# Altium schematic sheet 船核心板.SchDoc
size A2; Organization: Altium Limited; Address1: L3, 12a Rodborough Rd; Address2: Frenchs Forest; Address3: NSW; Address4: Australia 2086
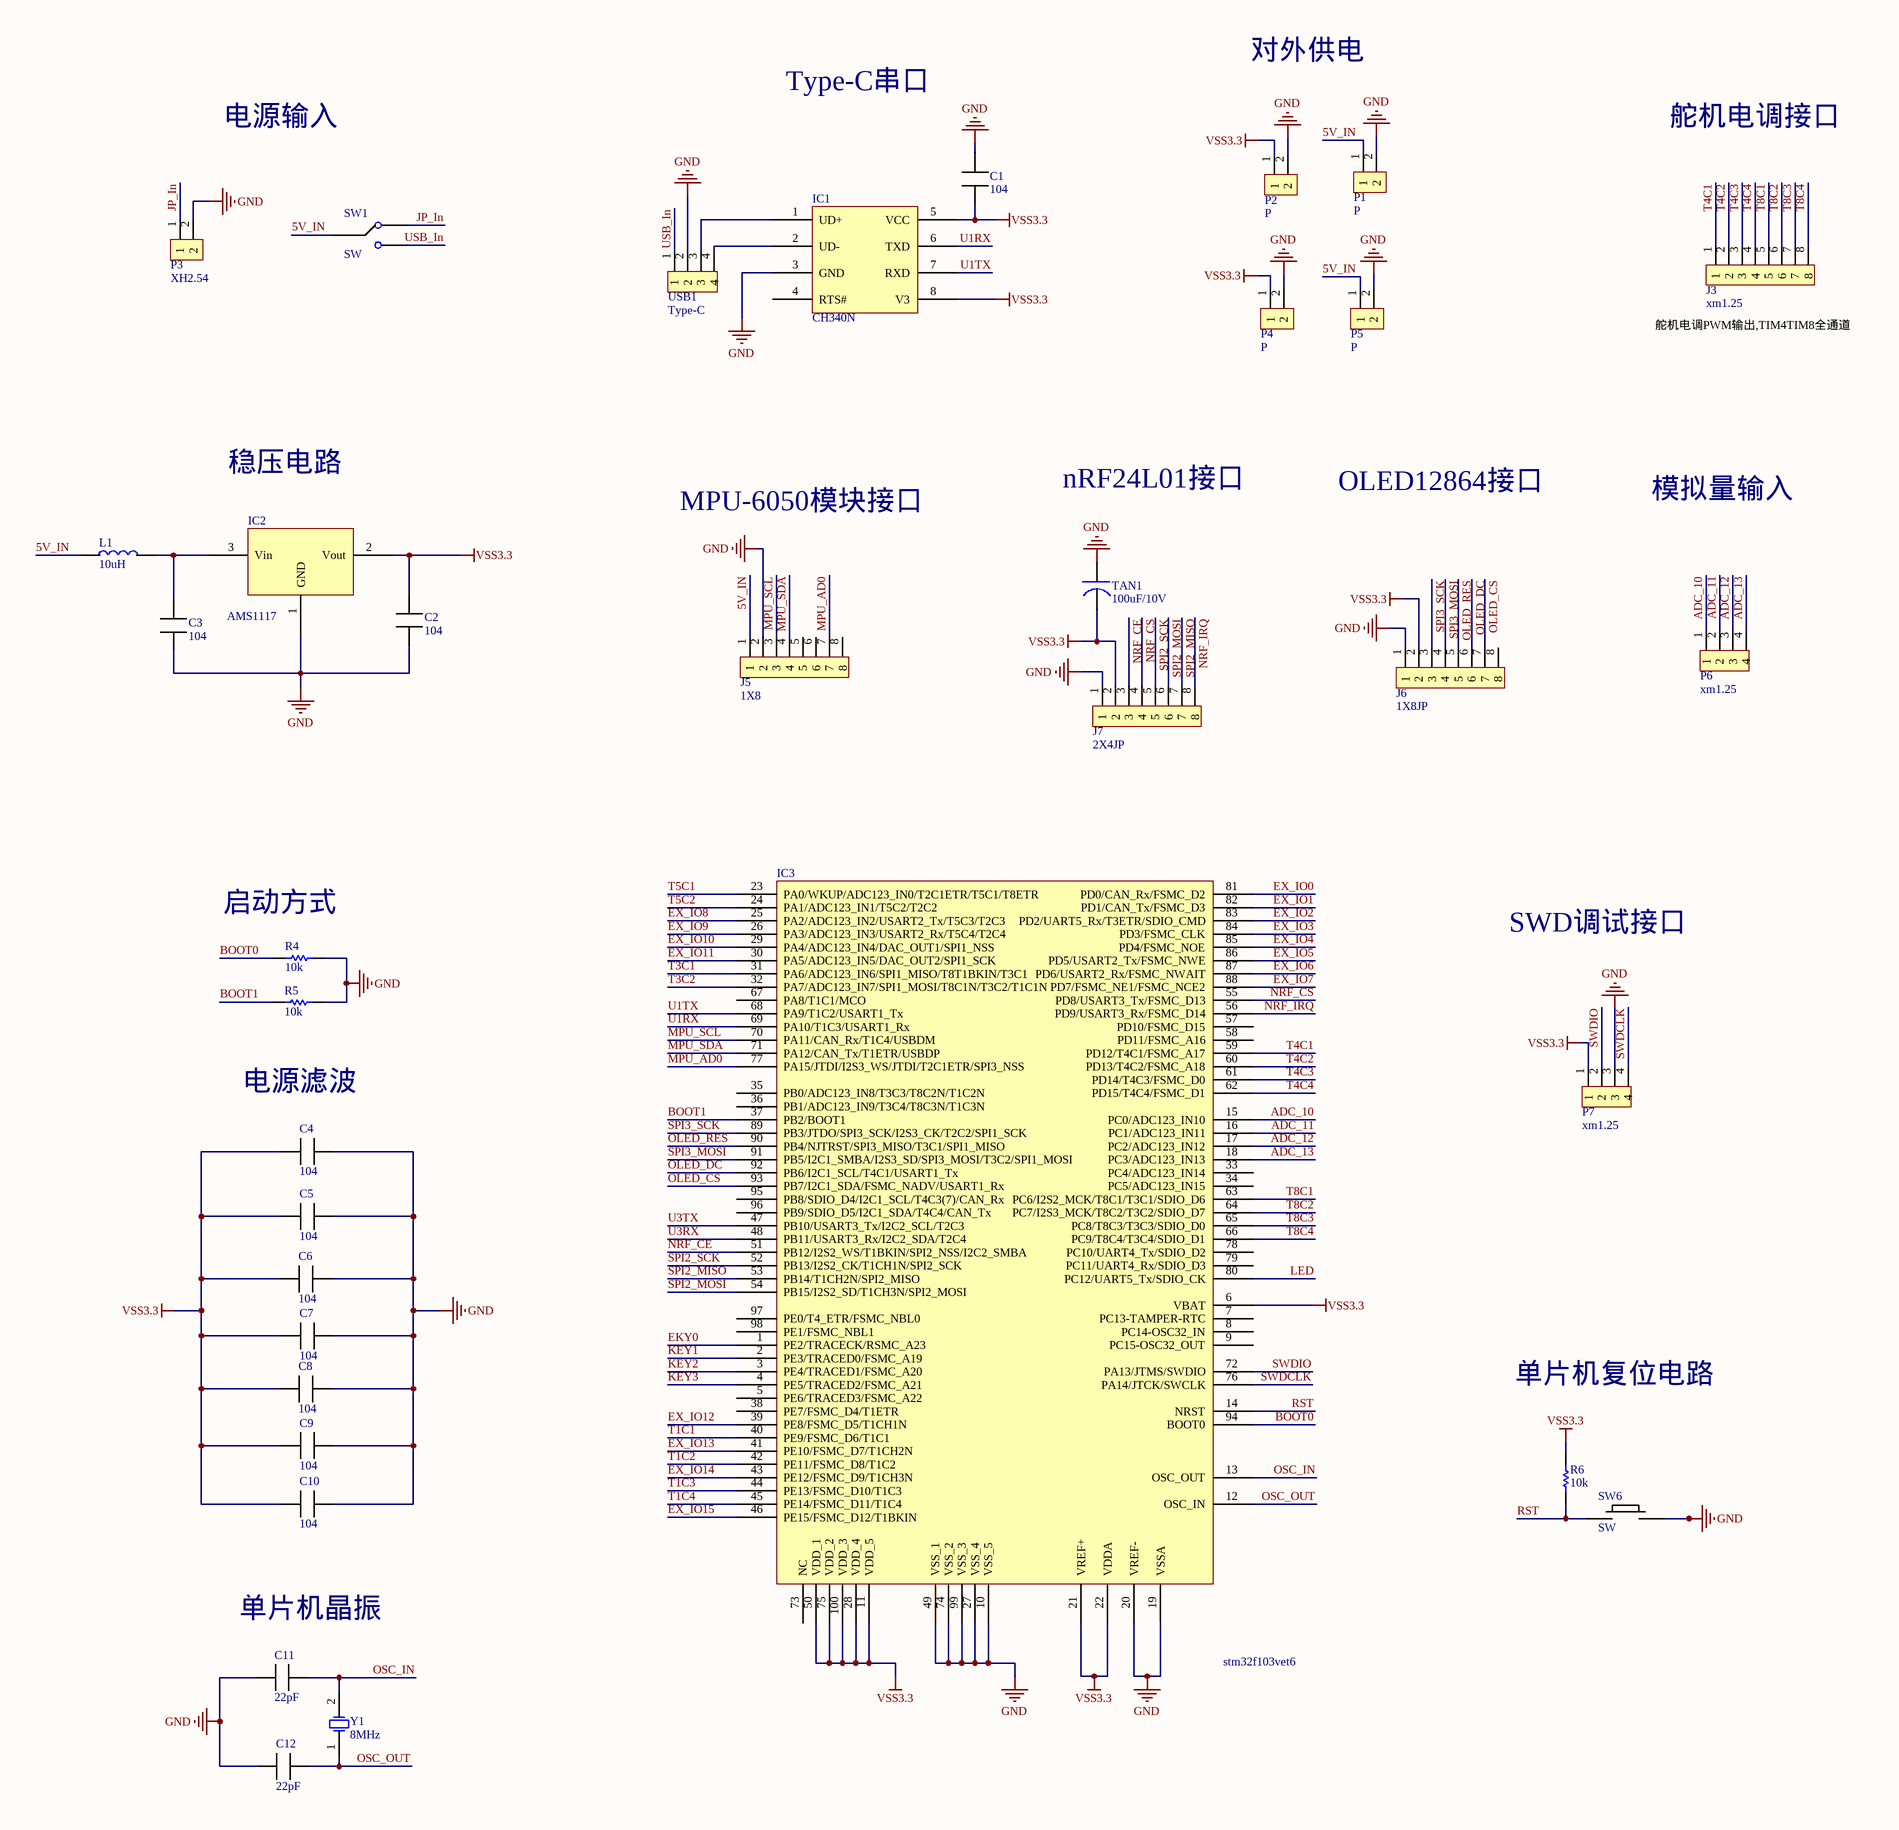
[diagram p0: 船核心板.SchDoc, left]
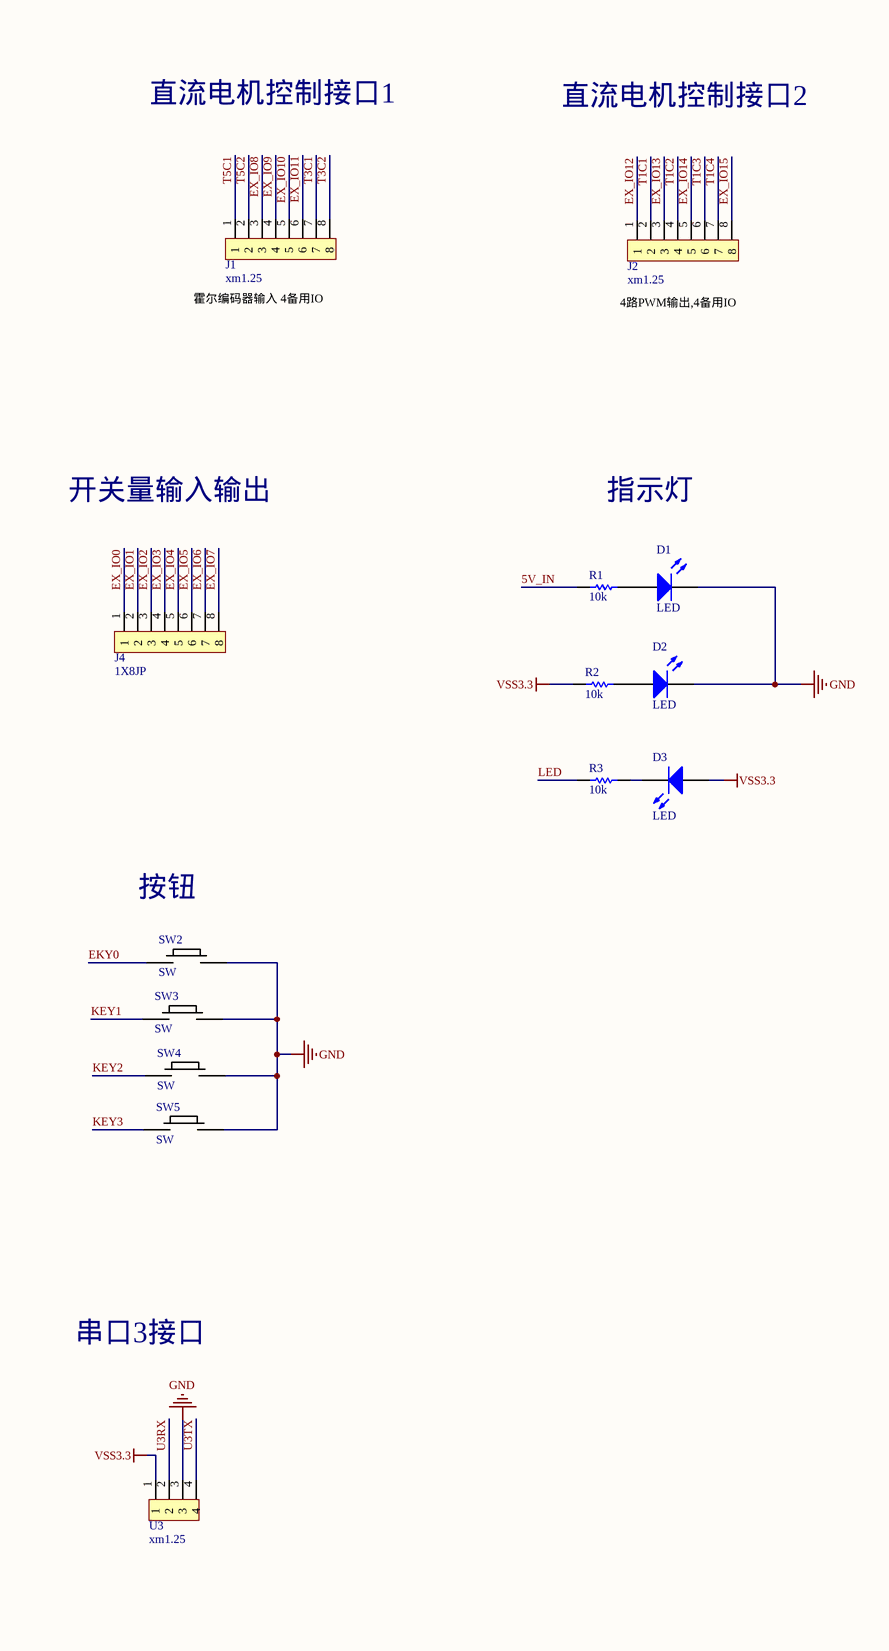
[diagram p1: 船核心板.SchDoc, right]

## Parts
C1  104  [C 0603]
C2  104  [C 0603]
C3  104  [C 0603]
C4  104  [C 0603]
C5  104  [C 0603]
C6  104  [C 0603]
C7  104  [C 0603]
C8  104  [C 0603]
C9  104  [C 0603]
C10  104  [C 0603]
C11  22pF  [C 0603]
C12  22pF  [C 0603]
D1  LED  [LED 0603]
D2  LED  [LED 0603]
D3  LED  [LED 0603]
IC1  CH340N  [SOP-8]
IC2  AMS1117  [SOT-223]
IC3  stm32f103vet6  [LQPF100 12X12]
J1  xm1.25  [MX1.25 8P]
J2  xm1.25  [MX1.25 8P]
J3  xm1.25  [MX1.25 8P]
J4  1X8JP  [HDR2.54-M-LI-8P]
J5  1X8  [HDR2.54-M-LI-8P]
J6  1X8JP  [HDR2.54-M-LI-8P]
J7  2X4JP  [HDR2.54-LI-2x4P]
L1  10uH  [L 0603]
P1  P  [XH2.54 2P]
P2  P  [XH2.54 2P]
P3  XH2.54  [XH2.54 2P]
P4  P  [XH2.54 2P]
P5  P  [XH2.54 2P]
P6  xm1.25  [MX1.25]
P7  xm1.25  [MX1.25]
R1  10k  [R 0603]
R2  10k  [R 0603]
R3  10k  [R 0603]
R4  10k  [R 0603]
R5  10k  [R 0603]
R6  10k  [R 0603]
SW1  SW  [拨动开关 9X3.5X3.5 侧卧]
SW2  SW  [SW SMD 3x6x2.5]
SW3  SW  [SW SMD 3x6x2.5]
SW4  SW  [SW SMD 3x6x2.5]
SW5  SW  [SW SMD 3x6x2.5]
SW6  SW  [SW SMD 3x6x2.5]
TAN1  100uF/10V  [6.3*5.4mm 电解电容]
U3  xm1.25  [2.54 _ 4Pin]
USB1  Type-C  [USB Type-C]
Y1  8MHz  [OSC SMD]

## Nets
GND: C1.2 C2.1 C3.1 C4.2 C5.2 C6.2 C7.2 C8.2 C9.2 C10.2 C11.1 C12.1 D1.2(K) D2.2(K) IC1.3(GND) IC2.1(GND) IC3.10(VSS_5) IC3.19(VSSA) IC3.20(VREF-) IC3.27(VSS_4) IC3.49(VSS_1) IC3.74(VSS_2) IC3.99(VSS_3) J5.2 J6.1 J7.1 P1.2 P2.2 P3.2 P4.2 P5.2 P7.3 R4.2 R5.2 SW2.2 SW3.2 SW4.2 SW5.2 SW6.2 TAN1.2 U3.3 USB1.2
VSS3.3: C1.1 C2.2 C4.1 C5.1 C6.1 C7.1 C8.1 C9.1 C10.1 D3.1(A) IC1.5(VCC) IC1.8(V3) IC2.2(Vout) IC3.6(VBAT) IC3.11(VDD_5) IC3.21(VREF+) IC3.22(VDDA) IC3.28(VDD_4) IC3.50(VDD_1) IC3.75(VDD_2) IC3.100(VDD_3) J6.2 J7.2 P2.1 P4.1 P7.1 R2.1 R6.2 TAN1.1 U3.1
5V_IN: J5.1 L1.1 P1.1 P5.1 R1.1 SW1.1
ADC_10: IC3.15(PC0/ADC123_IN10) P6.1
ADC_11: IC3.16(PC1/ADC123_IN11) P6.2
ADC_12: IC3.17(PC2/ADC123_IN12) P6.3
ADC_13: IC3.18(PC3/ADC123_IN13) P6.4
BOOT0: IC3.94(BOOT0) R4.1
BOOT1: IC3.37(PB2/BOOT1) R5.1
EKY0: IC3.1(PE2/TRACECK/RSMC_A23) SW2.1
EX_IO0: IC3.81(PD0/CAN_Rx/FSMC_D2) J4.1
EX_IO1: IC3.82(PD1/CAN_Tx/FSMC_D3) J4.2
EX_IO2: IC3.83(PD2/UART5_Rx/T3ETR/SDIO_CMD) J4.3
EX_IO3: IC3.84(PD3/FSMC_CLK) J4.4
EX_IO4: IC3.85(PD4/FSMC_NOE) J4.5
EX_IO5: IC3.86(PD5/USART2_Tx/FSMC_NWE) J4.6
EX_IO6: IC3.87(PD6/USART2_Rx/FSMC_NWAIT) J4.7
EX_IO7: IC3.88(PD7/FSMC_NE1/FSMC_NCE2) J4.8
EX_IO8: IC3.25(PA2/ADC123_IN2/USART2_Tx/T5C3/T2C3) J1.3
EX_IO9: IC3.26(PA3/ADC123_IN3/USART2_Rx/T5C4/T2C4) J1.4
EX_IO10: IC3.29(PA4/ADC123_IN4/DAC_OUT1/SPI1_NSS) J1.5
EX_IO11: IC3.30(PA5/ADC123_IN5/DAC_OUT2/SPI1_SCK) J1.6
EX_IO12: IC3.39(PE8/FSMC_D5/T1CH1N) J2.1
EX_IO13: IC3.41(PE10/FSMC_D7/T1CH2N) J2.3
EX_IO14: IC3.43(PE12/FSMC_D9/T1CH3N) J2.5
EX_IO15: IC3.46(PE15/FSMC_D12/T1BKIN) J2.8
JP_In: P3.1 SW1.2
KEY1: IC3.2(PE3/TRACED0/FSMC_A19) SW3.1
KEY2: IC3.3(PE4/TRACED1/FSMC_A20) SW4.1
KEY3: IC3.4(PE5/TRACED2/FSMC_A21) SW5.1
LED: IC3.80(PC12/UART5_Tx/SDIO_CK) R3.1
MPU_AD0: IC3.77(PA15/JTDI/I2S3_WS/JTDI/T2C1ETR/SPI3_NSS) J5.7
MPU_SCL: IC3.70(PA11/CAN_Rx/T1C4/USBDM) J5.3
MPU_SDA: IC3.71(PA12/CAN_Tx/T1ETR/USBDP) J5.4
NRF_CE: IC3.51(PB12/I2S2_WS/T1BKIN/SPI2_NSS/I2C2_SMBA) J7.3
NRF_CS: IC3.55(PD8/USART3_Tx/FSMC_D13) J7.4
NRF_IRQ: IC3.56(PD9/USART3_Rx/FSMC_D14) J7.8
OLED_CS: IC3.93(PB7/I2C1_SDA/FSMC_NADV/USART1_Rx) J6.7
OLED_DC: IC3.92(PB6/I2C1_SCL/T4C1/USART1_Tx) J6.6
OLED_RES: IC3.90(PB4/NJTRST/SPI3_MISO/T3C1/SPI1_MISO) J6.5
OSC_IN: C11.2 IC3.13(OSC_OUT) Y1.2(OSC2)
OSC_OUT: C12.2 IC3.12(OSC_IN) Y1.1(OSC1)
RST: IC3.14(NRST) R6.1 SW6.1
SPI2_MISO: IC3.53(PB14/T1CH2N/SPI2_MISO) J7.7
SPI2_MOSI: IC3.54(PB15/I2S2_SD/T1CH3N/SPI2_MOSI) J7.6
SPI2_SCK: IC3.52(PB13/I2S2_CK/T1CH1N/SPI2_SCK) J7.5
SPI3_MOSI: IC3.91(PB5/I2C1_SMBA/I2S3_SD/SPI3_MOSI/T3C2/SPI1_MOSI) J6.4
SPI3_SCK: IC3.89(PB3/JTDO/SPI3_SCK/I2S3_CK/T2C2/SPI1_SCK) J6.3
SWDCLK: IC3.76(PA14/JTCK/SWCLK) P7.4
SWDIO: IC3.72(PA13/JTMS/SWDIO) P7.2
T1C1: IC3.40(PE9/FSMC_D6/T1C1) J2.2
T1C2: IC3.42(PE11/FSMC_D8/T1C2) J2.4
T1C3: IC3.44(PE13/FSMC_D10/T1C3) J2.6
T1C4: IC3.45(PE14/FSMC_D11/T1C4) J2.7
T3C1: IC3.31(PA6/ADC123_IN6/SPI1_MISO/T8T1BKIN/T3C1) J1.7
T3C2: IC3.32(PA7/ADC123_IN7/SPI1_MOSI/T8C1N/T3C2/T1C1N) J1.8
T4C1: IC3.59(PD12/T4C1/FSMC_A17) J3.1
T4C2: IC3.60(PD13/T4C2/FSMC_A18) J3.2
T4C3: IC3.61(PD14/T4C3/FSMC_D0) J3.3
T4C4: IC3.62(PD15/T4C4/FSMC_D1) J3.4
T5C1: IC3.23(PA0/WKUP/ADC123_IN0/T2C1ETR/T5C1/T8ETR) J1.1
T5C2: IC3.24(PA1/ADC123_IN1/T5C2/T2C2) J1.2
T8C1: IC3.63(PC6/I2S2_MCK/T8C1/T3C1/SDIO_D6) J3.5
T8C2: IC3.64(PC7/I2S3_MCK/T8C2/T3C2/SDIO_D7) J3.6
T8C3: IC3.65(PC8/T8C3/T3C3/SDIO_D0) J3.7
T8C4: IC3.66(PC9/T8C4/T3C4/SDIO_D1) J3.8
U1RX: IC1.6(TXD) IC3.69(PA10/T1C3/USART1_Rx)
U1TX: IC1.7(RXD) IC3.68(PA9/T1C2/USART1_Tx)
U3RX: IC3.48(PB11/USART3_Rx/I2C2_SDA/T2C4) U3.2
U3TX: IC3.47(PB10/USART3_Tx/I2C2_SCL/T2C3) U3.4
USB_In: SW1.3 USB1.1
NetC3_2: C3.2 IC2.3(Vin) L1.2
NetD1_1: D1.1(A) R1.2
NetD2_1: D2.1(A) R2.2
NetD3_2: D3.2(K) R3.2
NetIC1_1: IC1.1(UD+) USB1.3
NetIC1_2: IC1.2(UD-) USB1.4

Not connected (* = marked no-connect by the designer): IC1 4(RTS#); IC3 5(PE6/TRACED3/FSMC_A22) 7(PC13-TAMPER-RTC) 8(PC14-OSC32_IN) 9(PC15-OSC32_OUT) 33(PC4/ADC123_IN14) 34(PC5/ADC123_IN15) 35(PB0/ADC123_IN8/T3C3/T8C2N/T1C2N) 36(PB1/ADC123_IN9/T3C4/T8C3N/T1C3N) 38(PE7/FSMC_D4/T1ETR) 57(PD10/FSMC_D15) 58(PD11/FSMC_A16) 67(PA8/T1C1/MCO) 73(NC) 78(PC10/UART4_Tx/SDIO_D2) 79(PC11/UART4_Rx/SDIO_D3) 95(PB8/SDIO_D4/I2C1_SCL/T4C3(7)/CAN_Rx) 96(PB9/SDIO_D5/I2C1_SDA/T4C4/CAN_Tx) 97(PE0/T4_ETR/FSMC_NBL0) 98(PE1/FSMC_NBL1); J5 5 6 8; J6 8

## Notes on the sheet
- 对外供电
- 电源输入
- Type-C串口
- 舵机电调接口
- 直流电机控制接口1
- 直流电机控制接口2
- (near J3) 舵机电调PWM输出,TIM4TIM8全通道
- (near J1) 霍尔编码器输入 4备用IO
- 4路PWM输出,4备用IO
- 稳压电路
- MPU-6050模块接口
- nRF24L01接口
- OLED12864接口
- 模拟量输入
- 开关量输入输出
- 指示灯
- (near R4) 启动方式
- 按钮
- SWD调试接口
- 电源滤波
- 单片机复位电路
- 串口3接口
- (near C11) 单片机晶振
- Title
- Size:
- Date:
- File:
- A2
- Number:
- Time:
- Revision:
- Sheet
- of

## Library data of the parts
C1-C12 = 电容
D1-D3 = LED: Typical INFRARED GaAs LED; Published: 8-Jun-2000; LatestRevisionDate: 08-Jul-2005; LatestRevisionNote: Mech Layer 1 removed.; PackageReference: LED-0; Publisher: Altium Limited; PackageDescription: LED; 2 Leads
IC2 = AMS1117-3.3
J1-J7 = 1X8排针
L1 = 电感
P1-P5 = 1X2排针
P6 P7 U3 = 1X4排针
R1-R6 = Res: Resistor; Published: 8-Jun-2000; LatestRevisionDate: 17-Jul-2002; LatestRevisionNote: Re-released for DXP Platform.; PackageReference: AXIAL-0.3; Publisher: Altium Limited; PackageDescription: Axial Device, Thru-Hole; 2 Leads; 0.3 in Pin Spacing
SW1 = 单刀双置开关: pin to pad: 1>2 2>3 3>1
SW2-SW6 = 弹簧开关
TAN1 = 极性电容
USB1 = 1X4排针: pin to pad: 1>A4 2>B1 3>A6 4>B7
Y1 = 晶振: Crystal Oscillator; Published: 8-Jun-2000; LatestRevisionDate: 17-Jul-2002; LatestRevisionNote: Re-released for DXP Platform.; PackageReference: R38; Publisher: Altium Limited; PackageDescription: Crystal, Thru-Hole; 2 Leads; Body 3.1 x 8.2 mm (Dia.xH)